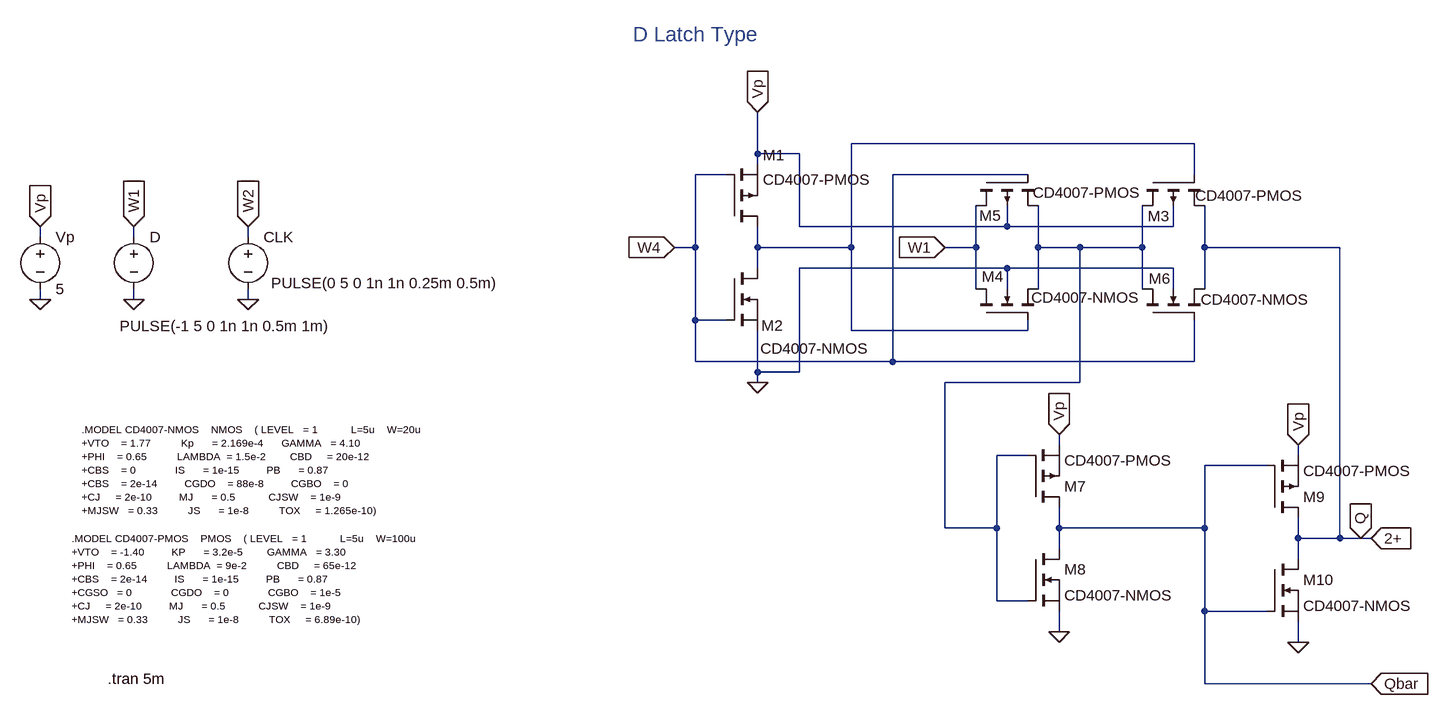
[diagram p0: schematic dtype_latch_ltspice.asc]
dtype_latch_ltspice.asc, the LTspice schematic file:
Version 4
SHEET 1 1060 892
WIRE 672 -32 144 -32
WIRE 0 -16 0 -80
WIRE 64 -16 0 -16
WIRE 0 0 0 -16
WIRE -48 16 -96 16
WIRE 416 16 208 16
WIRE 672 16 672 -32
WIRE 64 96 64 -16
WIRE 384 96 384 64
WIRE 384 96 64 96
WIRE 640 96 640 64
WIRE 640 96 384 96
WIRE -1104 112 -1104 96
WIRE -960 112 -960 96
WIRE -784 112 -784 96
WIRE -96 128 -96 16
WIRE -96 128 -128 128
WIRE 0 128 0 96
WIRE 144 128 144 -32
WIRE 144 128 0 128
WIRE 336 128 336 64
WIRE 336 128 288 128
WIRE 432 128 432 64
WIRE 496 128 432 128
WIRE 592 128 592 64
WIRE 592 128 496 128
WIRE 688 128 688 64
WIRE 896 128 688 128
WIRE 0 160 0 128
WIRE 384 160 64 160
WIRE 640 160 384 160
WIRE 336 192 336 128
WIRE 384 192 384 160
WIRE 432 192 432 128
WIRE 592 192 592 128
WIRE 640 192 640 160
WIRE 688 192 688 128
WIRE -1104 208 -1104 192
WIRE -960 208 -960 192
WIRE -784 208 -784 192
WIRE -96 240 -96 128
WIRE -48 240 -96 240
WIRE 144 256 144 128
WIRE 416 256 416 240
WIRE 416 256 144 256
WIRE -96 304 -96 240
WIRE 208 304 208 16
WIRE 208 304 -96 304
WIRE 672 304 672 240
WIRE 672 304 208 304
WIRE 0 320 0 256
WIRE 64 320 64 160
WIRE 64 320 0 320
WIRE 0 336 0 320
WIRE 496 336 496 128
WIRE 496 336 288 336
WIRE 464 432 464 416
WIRE 416 448 368 448
WIRE 832 448 832 432
WIRE 784 464 688 464
WIRE 288 560 288 336
WIRE 368 560 368 448
WIRE 368 560 288 560
WIRE 464 560 464 528
WIRE 688 560 688 464
WIRE 688 560 464 560
WIRE 832 576 832 544
WIRE 896 576 896 128
WIRE 896 576 832 576
WIRE 928 576 896 576
WIRE 944 576 928 576
WIRE 464 592 464 560
WIRE 832 608 832 576
WIRE 368 672 368 560
WIRE 416 672 368 672
WIRE 688 688 688 560
WIRE 784 688 688 688
WIRE 464 720 464 688
WIRE 832 736 832 704
WIRE 688 800 688 688
WIRE 944 800 688 800
FLAG 0 336 0
FLAG 0 -80 Vp
IOPIN 0 -80 In
FLAG -128 128 W4
IOPIN -128 128 In
FLAG 464 720 0
FLAG -1104 208 0
FLAG -1104 96 Vp
IOPIN -1104 96 In
FLAG 464 416 Vp
IOPIN 464 416 In
FLAG 832 736 0
FLAG 832 432 Vp
IOPIN 832 432 In
FLAG 944 576 2+
IOPIN 944 576 In
FLAG 288 128 W1
IOPIN 288 128 In
FLAG 944 800 Qbar
IOPIN 944 800 In
FLAG 928 576 Q
IOPIN 928 576 In
FLAG -960 208 0
FLAG -784 208 0
FLAG -960 96 W1
IOPIN -960 96 In
FLAG -784 96 W2
IOPIN -784 96 In
SYMBOL pmos -48 96 M180
WINDOW 0 56 110 Left 2
SYMATTR InstName M1
SYMATTR Value CD4007-PMOS
SYMBOL pmos 416 528 M180
SYMATTR InstName M7
SYMATTR Value CD4007-PMOS
SYMBOL nmos -48 160 R0
WINDOW 0 54 88 Left 2
WINDOW 3 52 124 Left 2
SYMATTR InstName M2
SYMATTR Value CD4007-NMOS
SYMBOL nmos 416 592 R0
SYMATTR InstName M8
SYMATTR Value CD4007-NMOS
SYMBOL voltage -1104 96 R0
WINDOW 123 0 0 Left 0
WINDOW 39 0 0 Left 0
SYMATTR InstName Vp
SYMATTR Value 5
SYMBOL pmos4 336 16 M90
WINDOW 0 63 39 VLeft 2
WINDOW 3 28 255 VLeft 2
SYMATTR InstName M5
SYMATTR Value CD4007-PMOS
SYMBOL pmos4 592 16 M90
WINDOW 0 64 42 VLeft 2
WINDOW 3 32 249 VLeft 2
SYMATTR InstName M3
SYMATTR Value CD4007-PMOS
SYMBOL nmos4 336 240 R270
WINDOW 0 67 9 VRight 2
WINDOW 3 35 85 VRight 2
SYMATTR InstName M4
SYMATTR Value CD4007-NMOS
SYMBOL nmos4 592 240 R270
WINDOW 0 64 10 VRight 2
WINDOW 3 32 90 VRight 2
SYMATTR InstName M6
SYMATTR Value CD4007-NMOS
SYMBOL pmos 784 544 M180
SYMATTR InstName M9
SYMATTR Value CD4007-PMOS
SYMBOL nmos 784 608 R0
SYMATTR InstName M10
SYMATTR Value CD4007-NMOS
SYMBOL voltage -960 96 R0
WINDOW 3 -22 153 Left 2
WINDOW 123 0 0 Left 0
WINDOW 39 0 0 Left 0
SYMATTR Value PULSE(-1 5 0 1n 1n 0.5m 1m)
SYMATTR InstName D
SYMBOL voltage -784 96 R0
WINDOW 3 35 87 Left 2
WINDOW 123 24 44 Left 2
WINDOW 39 0 0 Left 0
SYMATTR Value PULSE(0 5 0 1n 1n 0.25m 0.5m)
SYMATTR InstName CLK
TEXT -192 -200 Left 3 ;D Latch Type
TEXT -1040 408 Left 1 !.MODEL CD4007-NMOS    NMOS    ( LEVEL   = 1           L=5u    W=20u             \n+VTO    = 1.77          Kp      = 2.169e-4      GAMMA   = 4.10  \n+PHI    = 0.65          LAMBDA  = 1.5e-2        CBD     = 20e-12\n+CBS    = 0             IS      = 1e-15         PB      = 0.87\n+CBS    = 2e-14         CGDO    = 88e-8         CGBO    = 0\n+CJ     = 2e-10         MJ      = 0.5           CJSW    = 1e-9\n+MJSW   = 0.33          JS      = 1e-8          TOX     = 1.265e-10)
TEXT -1056 576 Left 1 !.MODEL CD4007-PMOS    PMOS    ( LEVEL   = 1           L=5u    W=100u                \n+VTO    = -1.40         KP      = 3.2e-5        GAMMA   = 3.30  \n+PHI    = 0.65          LAMBDA  = 9e-2          CBD     = 65e-12\n+CBS    = 2e-14         IS      = 1e-15         PB      = 0.87\n+CGSO   = 0             CGDO    = 0             CGBO    = 1e-5\n+CJ     = 2e-10         MJ      = 0.5           CJSW    = 1e-9\n+MJSW   = 0.33          JS      = 1e-8          TOX     = 6.89e-10)
TEXT -1000 792 Left 2 !.tran 5m

The netlist it stands for:
* dtype_latch_ltspice.asc
M1 N001 W4 Vp Vp CD4007-PMOS
M7 Qbar N002 Vp Vp CD4007-PMOS
M2 N001 W4 0 0 CD4007-NMOS
M8 Qbar N002 0 0 CD4007-NMOS
Vp Vp 0 5
M5 W1 W4 N002 Vp CD4007-PMOS
M3 N002 N001 Q Vp CD4007-PMOS
M4 W1 N001 N002 0 CD4007-NMOS
M6 N002 W4 Q 0 CD4007-NMOS
M9 Q Qbar Vp Vp CD4007-PMOS
M10 Q Qbar 0 0 CD4007-NMOS
V§D W1 0 PULSE(-1 5 0 1n 1n 0.5m 1m)
V§CLK W2 0 PULSE(0 5 0 1n 1n 0.25m 0.5m)
.model NMOS NMOS
.model PMOS PMOS
.lib standard.mos
* D Latch Type
.MODEL CD4007-NMOS    NMOS    ( LEVEL   = 1           L=5u    W=20u
+VTO    = 1.77          Kp      = 2.169e-4      GAMMA   = 4.10
+PHI    = 0.65          LAMBDA  = 1.5e-2        CBD     = 20e-12
+CBS    = 0             IS      = 1e-15         PB      = 0.87
+CBS    = 2e-14         CGDO    = 88e-8         CGBO    = 0
+CJ     = 2e-10         MJ      = 0.5           CJSW    = 1e-9
+MJSW   = 0.33          JS      = 1e-8          TOX     = 1.265e-10)
.MODEL CD4007-PMOS    PMOS    ( LEVEL   = 1           L=5u    W=100u
+VTO    = -1.40         KP      = 3.2e-5        GAMMA   = 3.30
+PHI    = 0.65          LAMBDA  = 9e-2          CBD     = 65e-12
+CBS    = 2e-14         IS      = 1e-15         PB      = 0.87
+CGSO   = 0             CGDO    = 0             CGBO    = 1e-5
+CJ     = 2e-10         MJ      = 0.5           CJSW    = 1e-9
+MJSW   = 0.33          JS      = 1e-8          TOX     = 6.89e-10)
.tran 5m
.backanno
.end